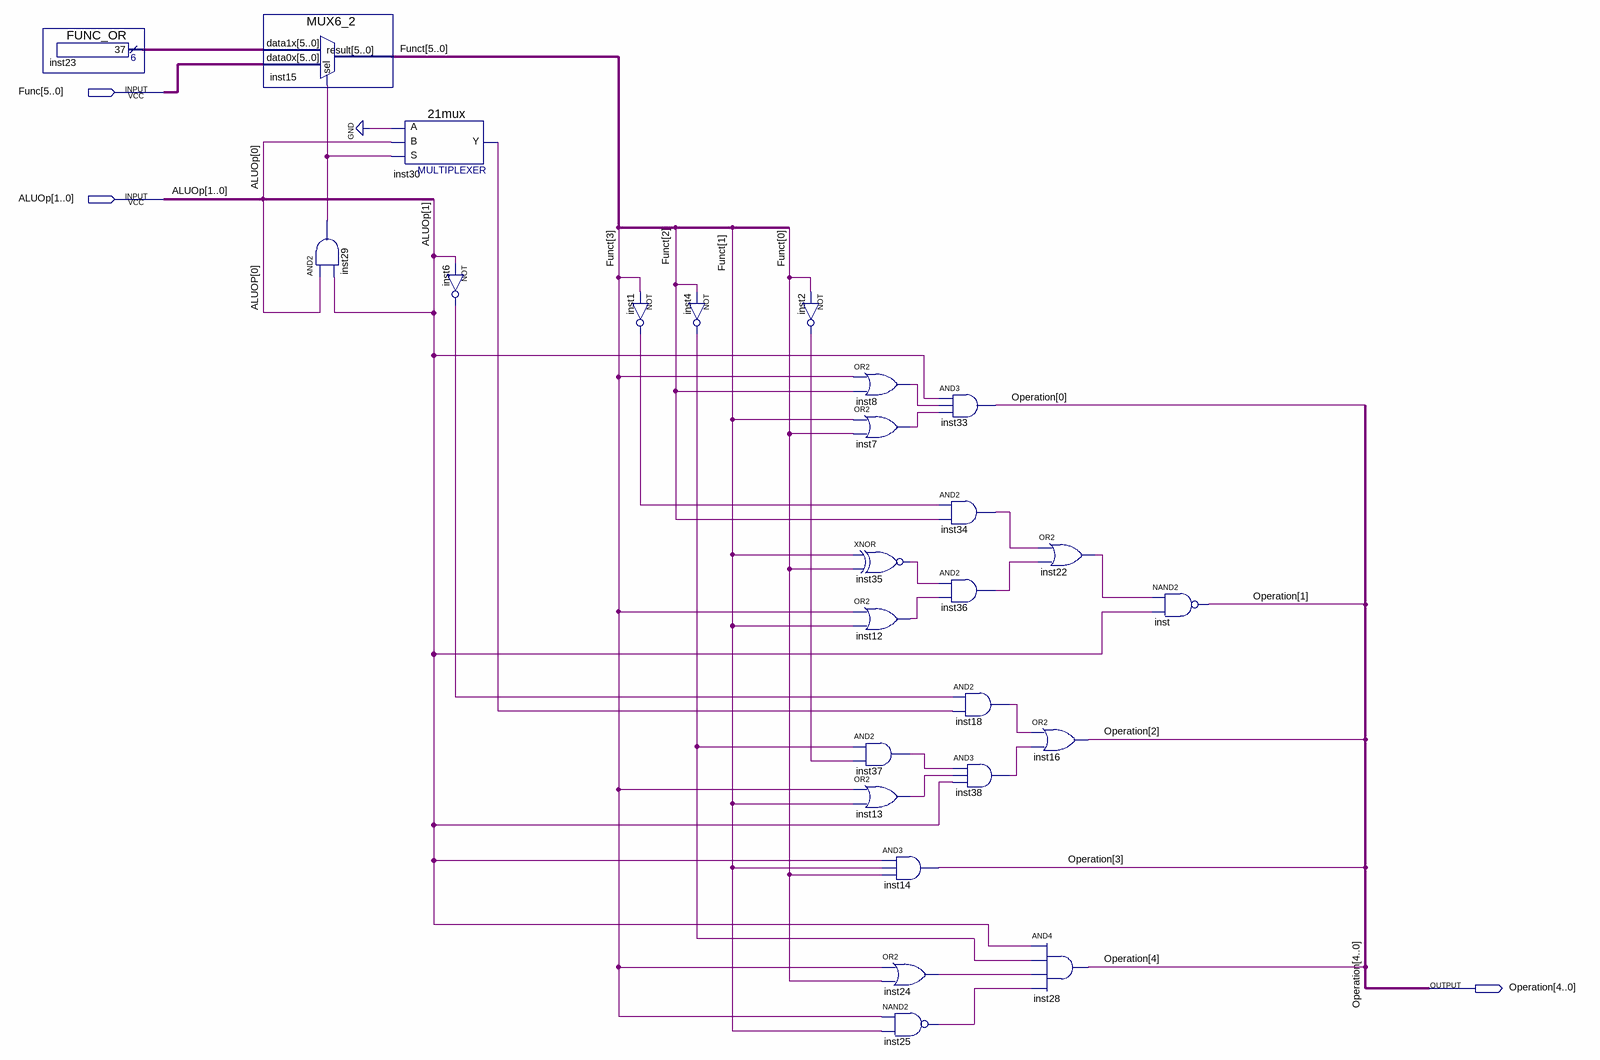
[diagram p0: schematic sheet]
// Quartus schematic ALUControl.bdf as structural Verilog: 26 symbols, 3 pins
module ALUControl (
  input  [5:0] Func,
  input  [1:0] ALUOp,
  output [4:0] Operation
);

  wire inst1_out, inst2_out, inst4_out, inst6_out, inst7_out, inst8_out, inst12_out, inst13_out, inst18_out,
       inst22_out, inst24_out, inst25_out, inst29_out, inst30_y, inst34_out, inst35_out, inst36_out,
       inst37_out, inst38_out;
  wire [5:0] Funct, inst23_result;

  FUNC_OR inst23 (.result(inst23_result));
  MUX6_2 inst15 (.data1x(inst23_result), .data0x(Func), .sel(inst29_out), .result(Funct));
  and inst29 (inst29_out, ALUOp[0], ALUOp[1]);
  \21mux  inst30 (.S(inst29_out), .B(ALUOp[0]), .A(1'b0), .Y(inst30_y));
  not inst6 (inst6_out, ALUOp[1]);
  not inst1 (inst1_out, Funct[3]);
  not inst4 (inst4_out, Funct[2]);
  not inst2 (inst2_out, Funct[0]);
  or inst8 (inst8_out, Funct[3], Funct[2]);
  or inst7 (inst7_out, Funct[1], Funct[0]);
  xnor inst35 (inst35_out, Funct[1], Funct[0]);
  or inst12 (inst12_out, Funct[3], Funct[1]);
  and inst37 (inst37_out, inst4_out, inst2_out);
  or inst13 (inst13_out, Funct[3], Funct[1]);
  and inst14 (Operation[3], ALUOp[1], Funct[1], Funct[0]);
  or inst24 (inst24_out, Funct[3], Funct[0]);
  nand inst25 (inst25_out, Funct[3], Funct[1]);
  and inst33 (Operation[0], ALUOp[1], inst8_out, inst7_out);
  and inst34 (inst34_out, inst1_out, Funct[2]);
  and inst36 (inst36_out, inst35_out, inst12_out);
  and inst18 (inst18_out, inst6_out, inst30_y);
  and inst38 (inst38_out, inst37_out, inst13_out, ALUOp[1]);
  or inst22 (inst22_out, inst34_out, inst36_out);
  or inst16 (Operation[2], inst18_out, inst38_out);
  and inst28 (Operation[4], ALUOp[1], inst4_out, inst24_out, inst25_out);
  nand inst (Operation[1], inst22_out, ALUOp[1]);
endmodule
